# Altium schematic sheet supplies.SchDoc
size A4; Organization: Altium Limited; Address1: L3, 12a Rodborough Rd; Address2: Frenchs Forest; Address3: NSW; Address4: Australia 2086
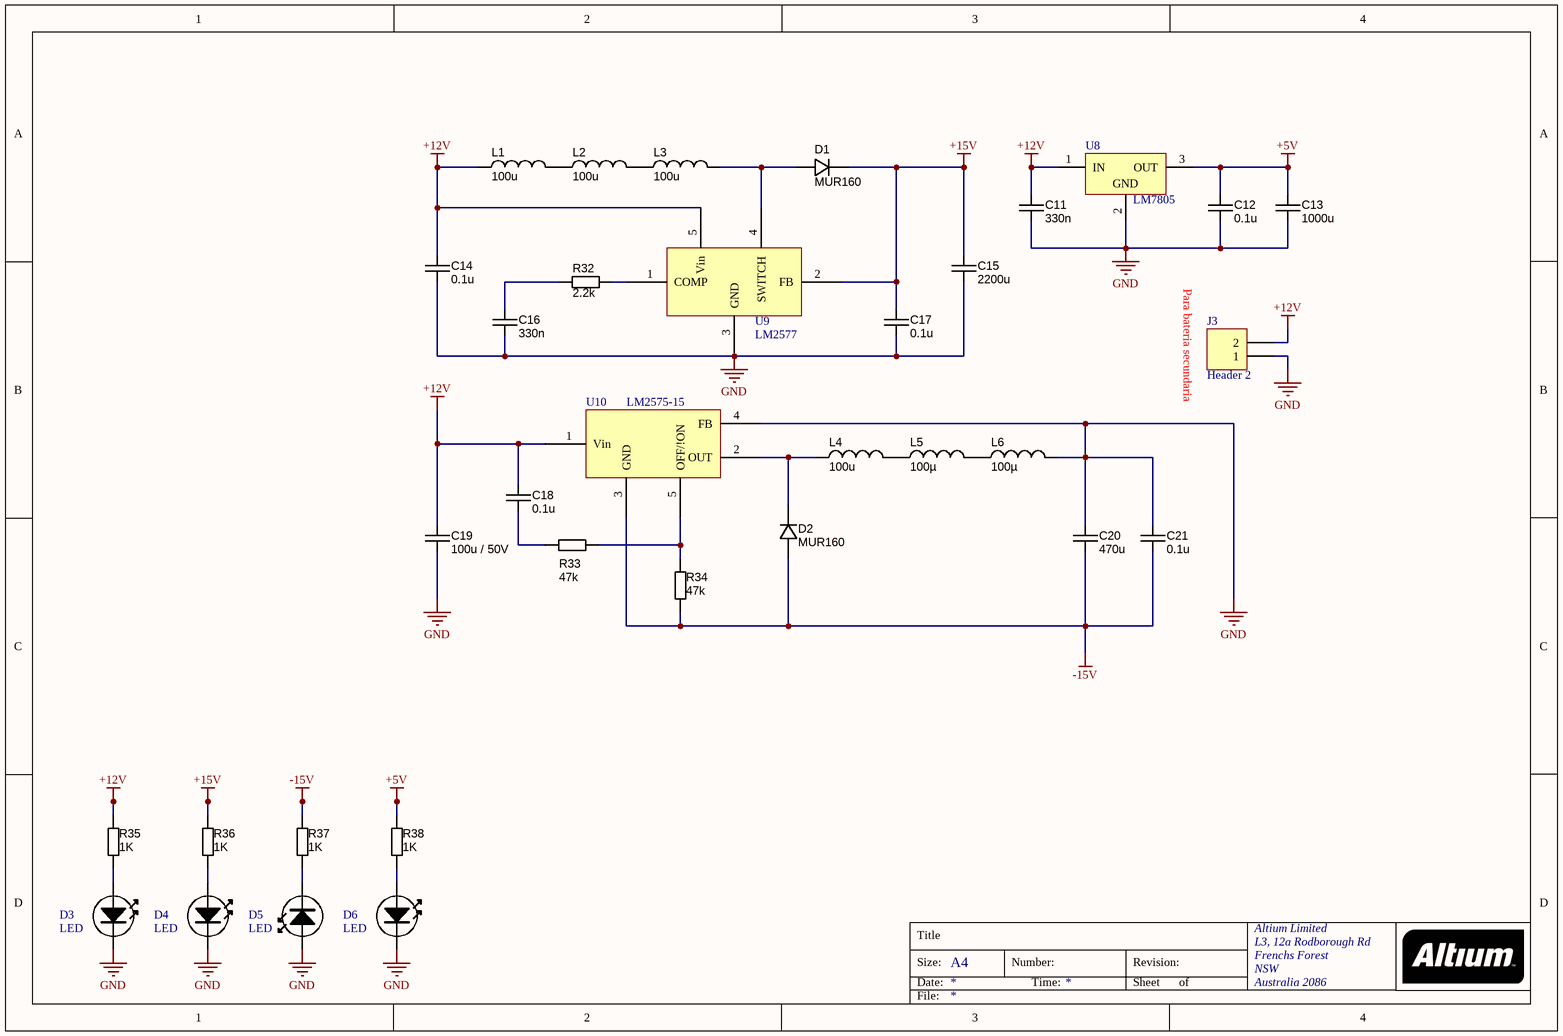
[diagram p0: supplies.SchDoc]

## Parts
C11  value 330n  [cap33n63v]  (hidden comment: approved sub OK)
C12  value 0.1u  [cap100n]  (hidden comment: approved sub OK)
C13  value 1000u  [cap1000u25v]  (hidden comment: approved sub OK)
C14  value 0.1u  [cap100n]  (hidden comment: approved sub OK)
C15  value 2200u  [cap2200u25v]  (hidden comment: approved sub OK)
C16  value 330n  [cap33n63v]  (hidden comment: approved sub OK)
C17  value 0.1u  [cap100n]  (hidden comment: approved sub OK)
C18  value 0.1u  [cap100n]  (hidden comment: approved sub OK)
C19  value 100u / 50V  [cap100u35v]  (hidden comment: approved sub OK)
C20  value 470u  [cap470u50v]  (hidden comment: approved sub OK)
C21  value 0.1u  [cap100n]  (hidden comment: approved sub OK)
D1  MUR160  [DO-41]
D2  MUR160  [DO-41]
D3  LED  [LED-3MM-BLUE]
D4  LED  [LED-3MM-BLUE]
D5  LED  [LED-3MM-BLUE]
D6  LED  [LED-3MM-BLUE]
J3  Header 2  [HDR1X2]
L1  value 100u  [Inductor]  (hidden comment: INDC_180u_Toroid)
L2  value 100u  [Inductor]  (hidden comment: INDC_180u_Toroid)
L3  value 100u  [Inductor]  (hidden comment: INDC_180u_Toroid)
L4  value 100u  [Inductor]  (hidden comment: INDC_180u_Toroid)
L5  value 100µ  [Inductor]  (hidden comment: INDC_180u_Toroid)
L6  value 100µ  [Inductor]  (hidden comment: INDC_180u_Toroid)
R32  value 2.2k  [RESTH_AXIAL-0.4]  (hidden comment: Carbon Film)
R33  value 47k  [RESTH_AXIAL-0.4]  (hidden comment: Carbon Film)
R34  value 47k  [RESTH_AXIAL-0.4]  (hidden comment: Carbon Film)
R35  value 1K  [RESTH_AXIAL-0.4]  (hidden comment: Carbon Film)
R36  value 1K  [RESTH_AXIAL-0.4]  (hidden comment: Carbon Film)
R37  value 1K  [RESTH_AXIAL-0.4]  (hidden comment: Carbon Film)
R38  value 1K  [RESTH_AXIAL-0.4]  (hidden comment: Carbon Film)
U8  LM7805  [T03B]
U9  LM2577  [T05A]
U10  LM2575-15  [T05A]

## Nets
+5V: C12.2 C13.2 R38.2 U8.3(OUT)
+12V: C11.2 C14.2 C18.2 C19.2 J3.2 L1.1 R35.2 U8.1(IN) U9.5(Vin) U10.1(Vin)
+15V: C15.2 C17.2 D1.K R36.2 U9.2(FB)
-15V: C20.1 C21.1 D2.A R34.1 R37.2 U10.3(GND)
GND: C11.1 C12.1 C13.1 C14.1 C15.1 C16.1 C17.1 C19.1 C20.2 C21.2 D3.K D4.K D5.A D6.K J3.1 L6.2 U8.2(GND) U9.3(GND) U10.4(FB)
NetC16_2: C16.2 R32.2
NetC18_1: C18.1 R33.1
NetD1_A: D1.A L3.2 U9.4(SWITCH)
NetD2_K: D2.K L4.1 U10.2(OUT)
NetD3_A: D3.A R35.1
NetD4_A: D4.A R36.1
NetD5_K: D5.K R37.1
NetD6_A: D6.A R38.1
NetL1_2: L1.2 L2.1
NetL2_2: L2.2 L3.1
NetL4_2: L4.2 L5.1
NetL5_2: L5.2 L6.1
NetR32_1: R32.1 U9.1(COMP)
NetR33_2: R33.2 R34.2 U10.5(OFF/!ON)

## Notes on the sheet
- Para bateria secundaria
- Title
- Size:
- Date:
- A4
- Number:
- Time:
- Revision:
- Sheet
- of
- File:

## Library data of the parts
C11-C21 = CAPC_330n_0805: Capacitor SMD Cer 330nF 10% 25V X7R 0805; Manufacturer: Kemet; Manufacturer Part Number: C0805C334K3RACTU; Ratings: 25V; X7R; Material: ceramic; Package / Case: 0805 (2012 metric); Tolerance: ±10%; Supplier 1: Mouser; Supplier Part Number 1: 80-C0805C334K3R
D1 D2 = DIODE_1N4007_1000V_1.0A_DO-41: Diode 1N4007 1A 1000V THD; Manufacturer 1: Diodes Inc; Manufacturer Part Number 1: 1N4007-T; Ratings: 100V; 1.5A; Diode Type: Standard; Value: Vf = 1.15V @ 1.5A (Max); Package / Case: DO-41; Mounting Type: Through Hole
D3-D6 = LED-BLUE-3MM
J3 = Header 2: Header, 2-Pin; LatestRevisionDate: 17-Jul-2002; LatestRevisionNote: Re-released for DXP Platform.; Publisher: Altium Limited
L1-L6 = INDC_180u_Toroid: Power Inductor 180µH 10% SMD Toroid; Manufacturer 1: JW Miller A Bourns Company; Manufacturer Part Number 1: PM2110-181K-RC; Ratings: 3.7A; Package / Case: 1.200" L x 1.000" W x 0.530" H; Tolerance: ±10%; Supplier 1: Digi-Key; Supplier Part Number 1: M8769-ND; Current: 3.7A
R32-R38 = RES_1K_Axial_0.25W_5%: Resistor THD Axial 1k Ohm 0.25W 5% Carbon Film; Manufacturer 1: Yageo; Manufacturer Part Number 1: CFR-25JB-1K0; Ratings: 1/4W; Tolerance: ±5%; Package / Case: Axial; Supplier 1: Digi-Key; Supplier Part Number 1: 1.0KQBK-ND
U8 = LM78M05CT: 3-Terminal Positive Voltage Regulators, 3-pin TO-220; Manufacturer: National Semiconductor; PackageTopMarking: NSUZXYTTE#*LM341T-5.0*LM78M05CT; PowerWise: N; CompType: LDO IC; Published: 4-Dec-2008; DatasheetVersion: Aug-2005; PackageVersion: revL, Jan-1992; PackageReference: T03B; Publisher: Altium Limited; PackageDescription: TO-220, Molded, 3 Lead, Straight; Supplier 1: Farnell; Supplier Part Number 1: 4467103; PartNumber: LM78M05CT; RoHS: N; PinCount: 3; ComponentLink1Description: LM78M05 Datasheet; ComponentLink1URL: http://www.national.com/ds/LM/LM78M05.pdf; ComponentLink2Description: LM78M05 Web Page; ComponentLink2URL: http://www.national.com/pf/LM/LM78M05.html; ComponentLink3Description: T03B Package Page; ComponentLink3URL: http://www.national.com/packaging/folders/t03b.html
U9 = LM2577: Boost
U10 = LM2575: Buck